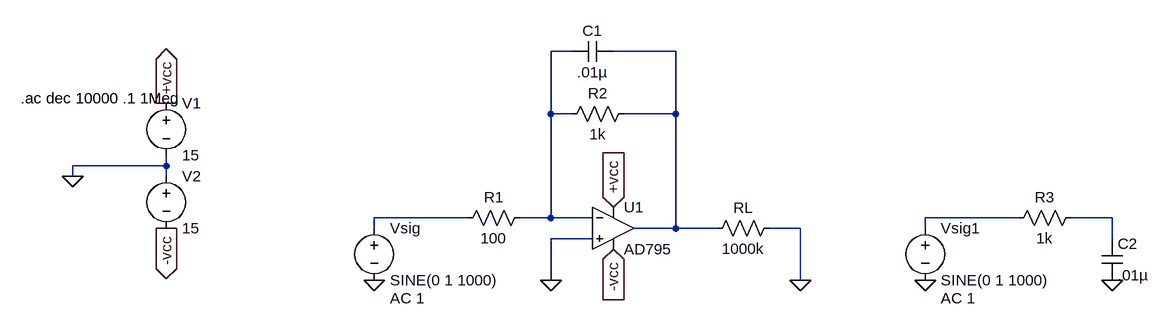
[diagram p0: schematic FILTRO - Passa_Baixa.asc]
FILTRO - Passa_Baixa.asc, the LTspice schematic file:
Version 4
SHEET 1 1008 680
WIRE 112 -96 80 -96
WIRE 272 -96 176 -96
WIRE 80 0 80 -96
WIRE 112 0 80 0
WIRE 272 0 272 -96
WIRE 272 0 192 0
WIRE -512 80 -512 64
WIRE -512 80 -656 80
WIRE -656 96 -656 80
WIRE -512 96 -512 80
WIRE -48 160 -192 160
WIRE 80 160 80 0
WIRE 80 160 32 160
WIRE 144 160 80 160
WIRE 800 160 656 160
WIRE 944 160 880 160
WIRE -192 176 -192 160
WIRE 272 176 272 0
WIRE 272 176 208 176
WIRE 336 176 272 176
WIRE 464 176 416 176
WIRE 656 176 656 160
WIRE 144 192 80 192
WIRE 944 192 944 160
WIRE 80 256 80 192
WIRE 464 256 464 176
FLAG -656 96 0
FLAG -512 -16 +vcc
IOPIN -512 -16 Out
FLAG -512 176 -vcc
IOPIN -512 176 Out
FLAG 176 144 +vcc
IOPIN 176 144 In
FLAG 176 208 -vcc
IOPIN 176 208 In
FLAG 80 256 0
FLAG -192 256 0
FLAG 464 256 0
FLAG 656 256 0
FLAG 944 256 0
SYMBOL voltage -512 -32 R0
SYMATTR InstName V1
SYMATTR Value 15
SYMBOL voltage -512 80 R0
SYMATTR InstName V2
SYMATTR Value 15
SYMBOL res 48 144 R90
WINDOW 0 0 56 VBottom 2
WINDOW 3 32 56 VTop 2
SYMATTR InstName R1
SYMATTR Value 100
SYMBOL res 208 -16 R90
WINDOW 0 0 56 VBottom 2
WINDOW 3 32 56 VTop 2
SYMATTR InstName R2
SYMATTR Value 1k
SYMBOL cap 176 -112 R90
WINDOW 0 0 32 VBottom 2
WINDOW 3 32 32 VTop 2
SYMATTR InstName C1
SYMATTR Value .01µ
SYMBOL voltage -192 160 R0
WINDOW 123 24 124 Left 2
WINDOW 39 0 0 Left 0
SYMATTR InstName Vsig
SYMATTR Value SINE(0 1 1000)
SYMATTR Value2 AC 1
SYMBOL res 432 160 R90
WINDOW 0 0 56 VBottom 2
WINDOW 3 32 56 VTop 2
SYMATTR InstName RL
SYMATTR Value 1000k
SYMBOL Opamps\\AD795 176 112 R0
SYMATTR InstName U1
SYMBOL res 896 144 R90
WINDOW 0 0 56 VBottom 2
WINDOW 3 32 56 VTop 2
SYMATTR InstName R3
SYMATTR Value 1k
SYMBOL voltage 656 160 R0
WINDOW 123 24 124 Left 2
WINDOW 39 0 0 Left 0
SYMATTR InstName Vsig1
SYMATTR Value SINE(0 1 1000)
SYMATTR Value2 AC 1
SYMBOL cap 928 192 R0
SYMATTR InstName C2
SYMATTR Value .01µ
TEXT -736 -24 Left 2 !.ac dec 10000 .1 1Meg

The netlist it stands for:
* FILTRO - Passa_Baixa.asc
V1 +vcc 0 15
V2 0 -vcc 15
R1 N001 N003 100
R2 N002 N001 1k
C1 N002 N001 .01µ
Vsig N003 0 SINE(0 1 1000) AC 1
RL 0 N002 1000k
XU1 0 N001 +vcc -vcc N002 AD795  ; pins In+ In- V+ V- OUT
R3 N005 N004 1k
Vsig1 N004 0 SINE(0 1 1000) AC 1
C2 N005 0 .01µ
.ac dec 10000 .1 1Meg
.lib ADI1.lib
.backanno
.end